# EAGLE schematic SphereFreezerMonitor (EAGLE 9.5.2)
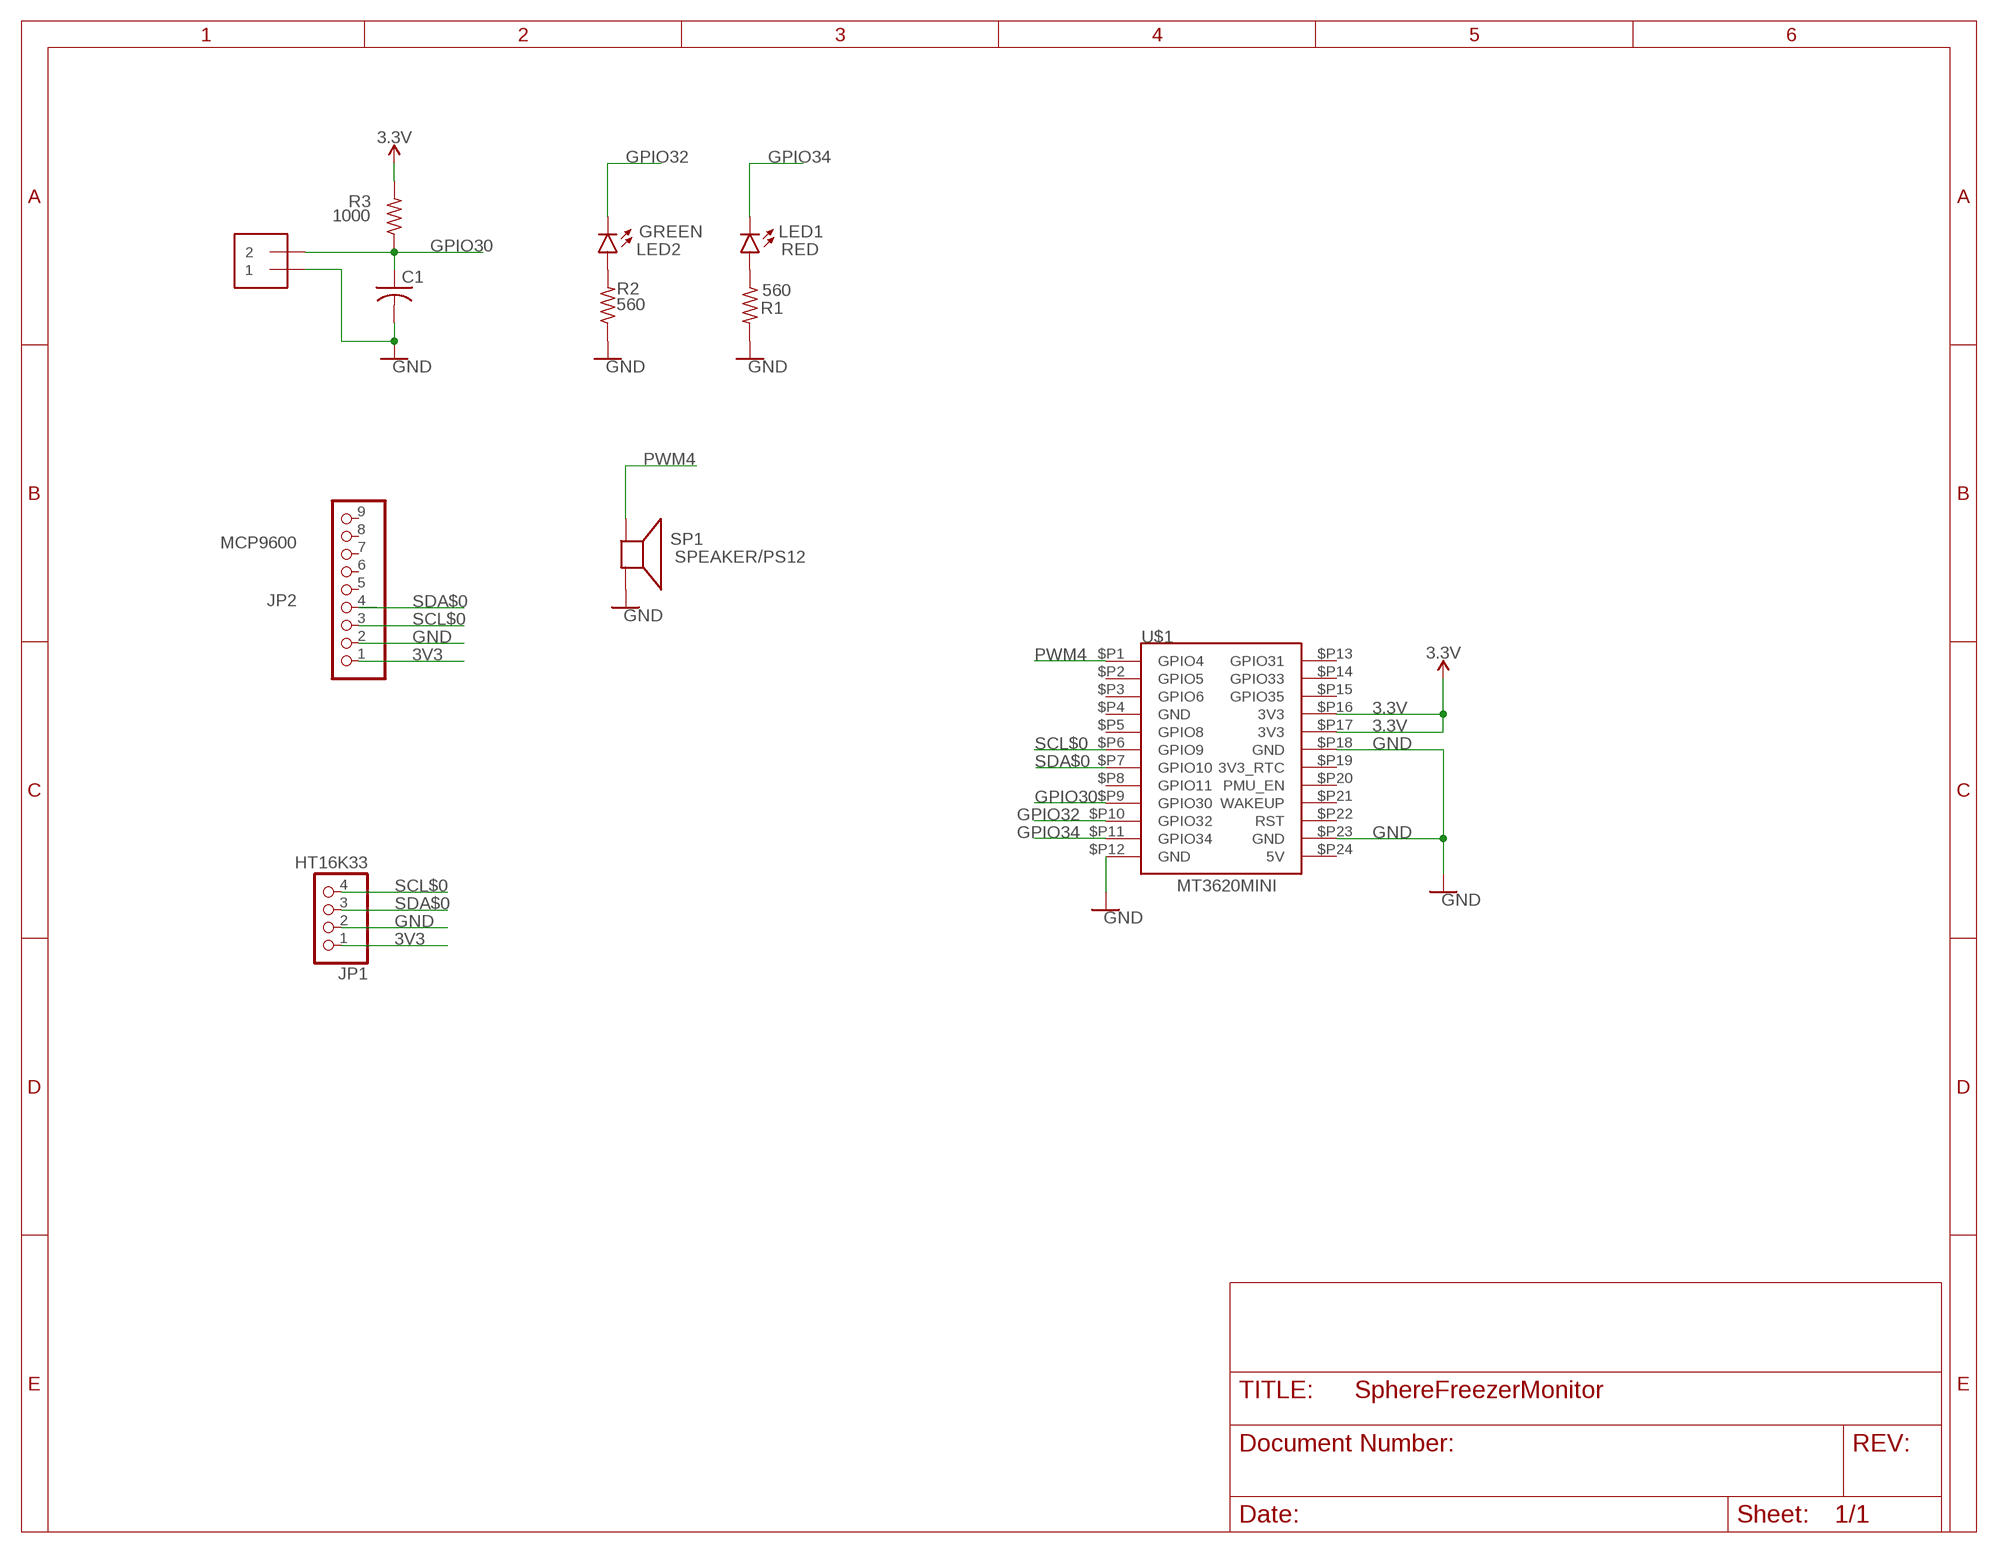
[diagram p0: schematic, sheet 1]

## Parts
C1  C-US025-025X050  [C025-025X050]
J1  1X2-3.5MM  [1X2-3.5MM]
JP1  HT16K33  PINHD-1X4  [1X04]
JP2  MCP9600  PINHD-1X9  [1X09]
LED1  RED  LED10MM  [LED10MM]
LED2  GREEN  LED10MM  [LED10MM]
R1  560  R-US_0207/9  [0207/9]
R2  560  R-US_0207/9  [0207/9]
R3  1000  R-US_0207/9  [0207/9]
SP1  SPEAKER/PS12  [PS12]
U$1  MT3620MINI  [MT3620MINI]

## Nets
3.3V: R3.2 U$1.$P16(3V3) U$1.$P17(3V3)
3V3: JP1.1 JP2.1
GND: C1.2 J1.1 JP1.2 JP2.2 R1.2 R2.1 SP1.P$2(-) U$1.$P12(GND) U$1.$P18(GND) U$1.$P23(GND)
GPIO30: C1.1 J1.2 R3.1 U$1.$P9(GPIO30)
GPIO32: LED2.K(C) U$1.$P10(GPIO32)
GPIO34: LED1.K(C) U$1.$P11(GPIO34)
N$1: LED1.A R1.1
N$2: LED2.A R2.2
PWM4: SP1.P$1(+) U$1.$P1(GPIO4)
SCL$0: JP1.4 JP2.3 U$1.$P6(GPIO9)
SDA$0: JP1.3 JP2.4 U$1.$P7(GPIO10)
Unconnected: JP2.5 JP2.6 JP2.7 JP2.8 JP2.9 U$1.$P2(GPIO5) U$1.$P3(GPIO6) U$1.$P4(GND) U$1.$P5(GPIO8) U$1.$P8(GPIO11) U$1.$P13(GPIO31) U$1.$P14(GPIO33) U$1.$P15(GPIO35) U$1.$P20(PMU_EN) U$1.$P21(WAKEUP) U$1.$P22(RST) U$1.$P24(5V)

## Power pins joined to a net without a drawn wire
3V3_RTC: U$1.$P19(3V3_RTC)

## Library data of the parts
C1 = adafruit:C-US: CAPACITOR, American symbol
J1 = adafruit:1X2: 3.5mm Terminal block http://www.ladyada.net/library/pcb/eaglelibrary.html
JP1 = pinhead:PINHD-1X4: PIN HEADER
JP2 = pinhead:PINHD-1X9: PIN HEADER
LED1 LED2 = led:LED: LED OSRAM: - CHIPLED LG R971, LG N971, LY N971, LG Q971, LY Q971, LO R971, LY R971 LH N974, LH R974 LS Q976, LO Q976, LY Q976 LO Q996 - Hyper CHIPLED LW Q18S LB Q993, LB Q99A, LB R99A - SideLED LS A670, LO A670, LY A670, LG A670, LP A670 LB A673, LV A673, LT A673, LW A673 LH A674 LY A675 LS A676, LA A676, LO A676, LY A676, LW A676 LS A679, LY A679, LG A679 - Hyper Micro SIDELED® LS Y876, LA Y876, LO Y876, LY Y876 LT Y87S - SmartLED LW L88C, LW L88S LB L89C, LB L89S, LG L890 LS L89K, LO L89K, LY L89K LS L896, LA L896, LO L896, LY L896 - TOPLED LS T670, LO T670, LY T670, LG T670, LP T670 LSG T670, LSP T670, LSY T670, LOP T670, LYG T670 LG T671, LOG T671, LSG T671 LB T673, LV T673, LT T673, LW T673 LH T674 LS T676, LA T676, LO T676, LY T676, LB T676, LH T676, LSB T676, LW T676 LB T67C, LV T67C, LT T67C, LS T67K, LO T67K, LY T67K, LW E67C LS E67B, LA E67B, LO E67B, LY E67B, LB E67C, LV E67C, LT E67C LW T67C LS T679, LY T679, LG T679 LS T770, LO T770, LY T770, LG T770, LP T770 LB T773, LV T773, LT T773, LW T773 LH T774 LS E675, LA E675, LY E675, LS T675 LS T776, LA T776, LO T776, LY T776, LB T776 LHGB T686 LT T68C, LB T68C - Hyper Mini TOPLED® LB M676 - Mini TOPLED Santana® LG M470 LS M47K, LO M47K, LY M47K Source: http://www.osram.convergy.de LUXEON: - LUMILED® LXK2-PW12-R00, LXK2-PW12-S00, LXK2-PW14-U00, LXK2-PW14-V00 LXK2-PM12-R00, LXK2-PM12-S00, LXK2-PM14-U00 LXK2-PE12-Q00, LXK2-PE12-R00, LXK2-PE12-S00, LXK2-PE14-T00, LXK2-PE14-U00 LXK2-PB12-K00, LXK2-PB12-L00, LXK2-PB12-M00, LXK2-PB14-N00, LXK2-PB14-P00, LXK2-PB14-Q00 LXK2-PR12-L00, LXK2-PR12-M00, LXK2-PR14-Q00, LXK2-PR14-R00 LXK2-PD12-Q00, LXK2-PD12-R00, LXK2-PD12-S00 LXK2-PH12-R00, LXK2-PH12-S00 LXK2-PL12-P00, LXK2-PL12-Q00, LXK2-PL12-R00 Source: www.luxeon.com KINGBRIGHT: KA-3528ASYC Source: www.kingbright.com
R1-R3 = adafruit:R-US_: RESISTOR, American symbol
SP1 = adafruit:SPEAKER: SPEAKER Source: Buerklin Added PS12 (for part # PS1240 piezo) http://www.ladyada.net/library/pcb/eaglelibrary.html
U$1 = azuresphere:MT3620MINI